# Altium schematic sheet Diff2SE.SchDoc
size A4
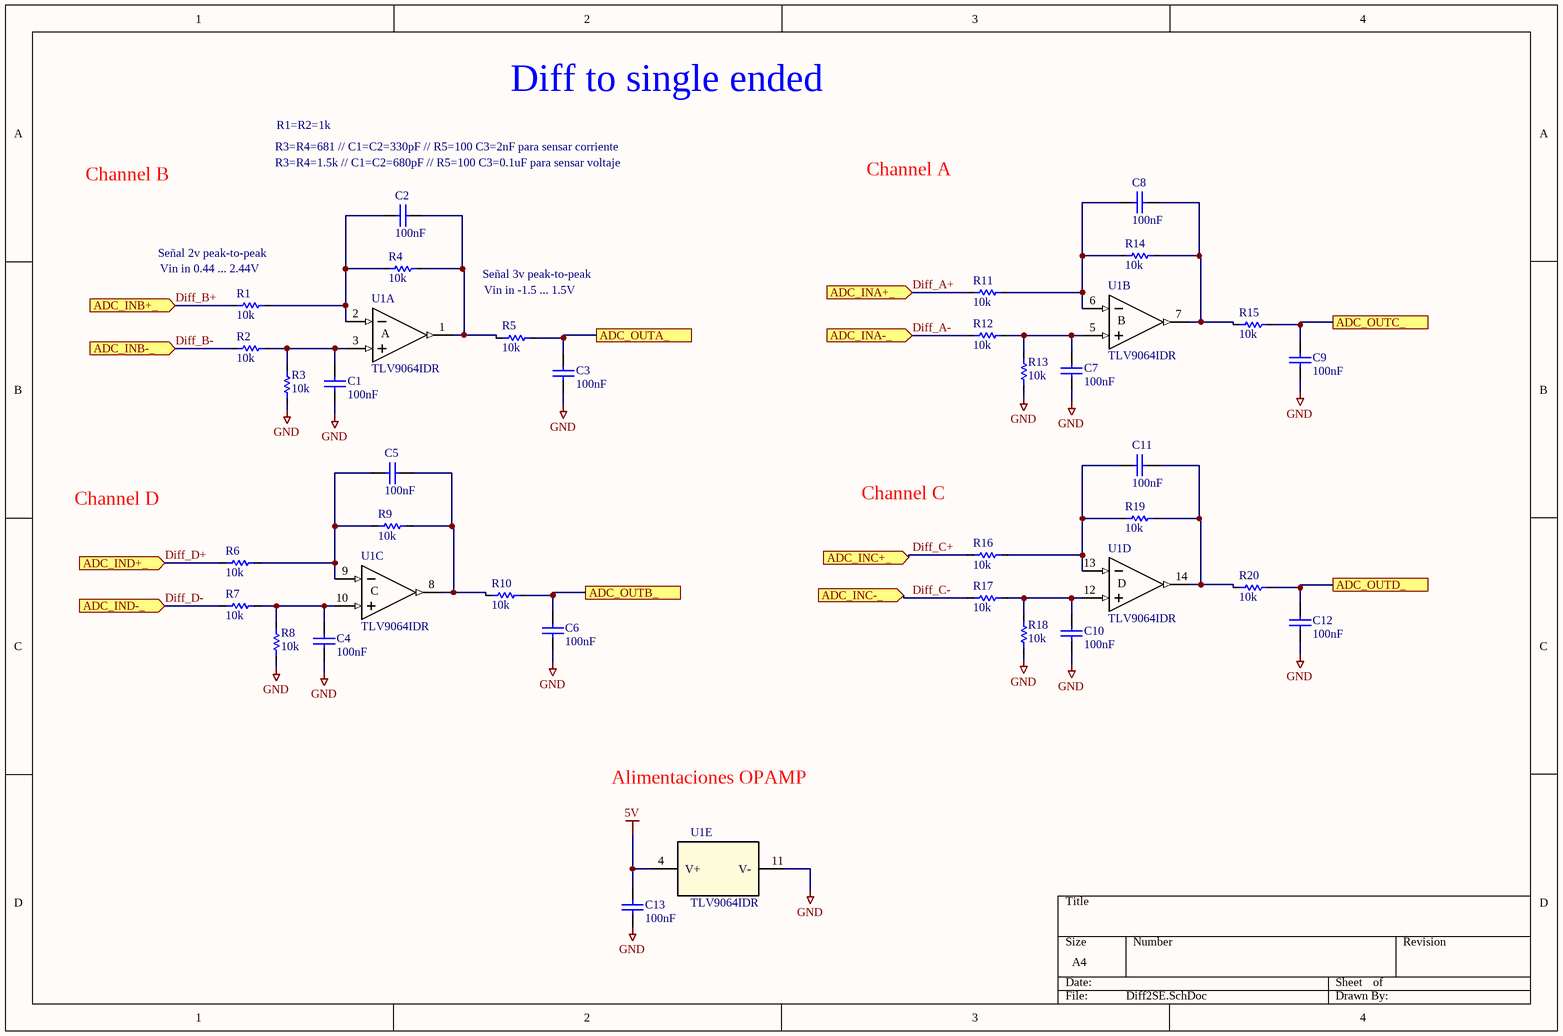
[diagram p0: Diff2SE.SchDoc]

## Parts
C1  100nF  [CAP_0603]
C2  100nF  [CAP_0603]
C3  100nF  [CAP_0603]
C4  100nF  [CAP_0603]
C5  100nF  [CAP_0603]
C6  100nF  [CAP_0603]
C7  100nF  [CAP_0603]
C8  100nF  [CAP_0603]
C9  100nF  [CAP_0603]
C10  100nF  [CAP_0603]
C11  100nF  [CAP_0603]
C12  100nF  [CAP_0603]
C13  100nF  [CAP_0603]
R1  10k  [RES_0603]
R2  10k  [RES_0603]
R3  10k  [RES_0603]
R4  10k  [RES_0603]
R5  10k  [RES_0603]
R6  10k  [RES_0603]
R7  10k  [RES_0603]
R8  10k  [RES_0603]
R9  10k  [RES_0603]
R10  10k  [RES_0603]
R11  10k  [RES_0603]
R12  10k  [RES_0603]
R13  10k  [RES_0603]
R14  10k  [RES_0603]
R15  10k  [RES_0603]
R16  10k  [RES_0603]
R17  10k  [RES_0603]
R18  10k  [RES_0603]
R19  10k  [RES_0603]
R20  10k  [RES_0603]
U1  TLV9064IDR  [D0014A_N]  (parts A,B,C,D,E of 5)

## Ports
ADC_INA+_ (in), ADC_INA-_ (in), ADC_INB+_ (in), ADC_INB-_ (in), ADC_INC+_ (in), ADC_INC-_ (in), ADC_IND+_ (in), ADC_IND-_ (in), ADC_OUTA_, ADC_OUTB_, ADC_OUTC_, ADC_OUTD_

## Nets
5V: C13.1 U1.4(V+)
GND: C1.2 C3.2 C4.2 C6.2 C7.2 C9.2 C10.2 C12.2 C13.2 R3.2 R8.2 R13.2 R18.2 U1.11(V-)
ADC_OUTA_: C3.1 R5.2 ; port ADC_OUTA_
ADC_OUTB_: C6.1 R10.2 ; port ADC_OUTB_
ADC_OUTC_: C9.1 R15.2 ; port ADC_OUTC_
ADC_OUTD_: C12.1 R20.2 ; port ADC_OUTD_
Diff_A+: R11.1 ; port ADC_INA+_
Diff_A-: R12.1 ; port ADC_INA-_
Diff_B+: R1.1 ; port ADC_INB+_
Diff_B-: R2.1 ; port ADC_INB-_
Diff_C+: R16.1 ; port ADC_INC+_
Diff_C-: R17.1 ; port ADC_INC-_
Diff_D+: R6.1 ; port ADC_IND+_
Diff_D-: R7.1 ; port ADC_IND-_
NetC1_1: C1.1 R2.2 R3.1 U1.3(IN+)
NetC2_1: C2.1 R1.2 R4.1 U1.2(IN-)
NetC2_2: C2.2 R4.2 R5.1 U1.1(OUT)
NetC4_1: C4.1 R7.2 R8.1 U1.10(IN+)
NetC5_1: C5.1 R6.2 R9.1 U1.9(IN-)
NetC5_2: C5.2 R9.2 R10.1 U1.8(OUT)
NetC7_1: C7.1 R12.2 R13.1 U1.5(IN+)
NetC8_1: C8.1 R11.2 R14.1 U1.6(IN-)
NetC8_2: C8.2 R14.2 R15.1 U1.7(OUT)
NetC10_1: C10.1 R17.2 R18.1 U1.12(IN+)
NetC11_1: C11.1 R16.2 R19.1 U1.13(IN-)
NetC11_2: C11.2 R19.2 R20.1 U1.14(OUT)

## Notes on the sheet
- Diff to single ended
- Channel B
- R3=R4=681 // C1=C2=330pF // R5=100 C3=2nF para sensar corriente
- (near C2) R3=R4=1.5k // C1=C2=680pF // R5=100 C3=0.1uF para sensar voltaje
- R1=R2=1k
- Channel A
- (near R1) Señal 2v peak-to-peak
- (near R1) Vin in 0.44 ... 2.44V
- Señal 3v peak-to-peak
- Vin in -1.5 ... 1.5V
- Channel D
- Channel C
- Alimentaciones OPAMP
- (in symbol TLV9064IDR, part A) A
- (in symbol TLV9064IDR, part B) B
- (in symbol TLV9064IDR, part C) C
- (in symbol TLV9064IDR, part D) D

## Library data of the parts
C1-C13 = Cap_0603: 0.1µF ±10% 50V Ceramic Capacitor X7R 0603 (1608 Metric); MF: KEMET; MFP: C0603C104K5RACTU; Created: 2020_06_15_DAarancibia; Package: 0603; Value: 100nF; Supplier 1: Digi-Key; Supplier Part Number 1: 399-5089-1-ND
R1-R20 = Res_0603: 10 kOhms ±1% 0.1W, 1/10W Chip Resistor 0402 (1005 Metric) Anti-Sulfur, Automotive AEC-Q200 Thick Film; MF: Panasonic Electronic Components; MFP: ERJ-3EKF1002V; Created: 2020_06_15_DAarancibia; Package: 0603; Value: 10k; Supplier 1: Digi-Key; Supplier Part Number 1: P10.0KHCT-ND
U1 = TLV9064IDR: No Description Available; Mfr_Name: Texas Instruments; TYPE: TYPE; RefDes: RefDes